# EAGLE design V9958 Video Card (EAGLE 4.16)
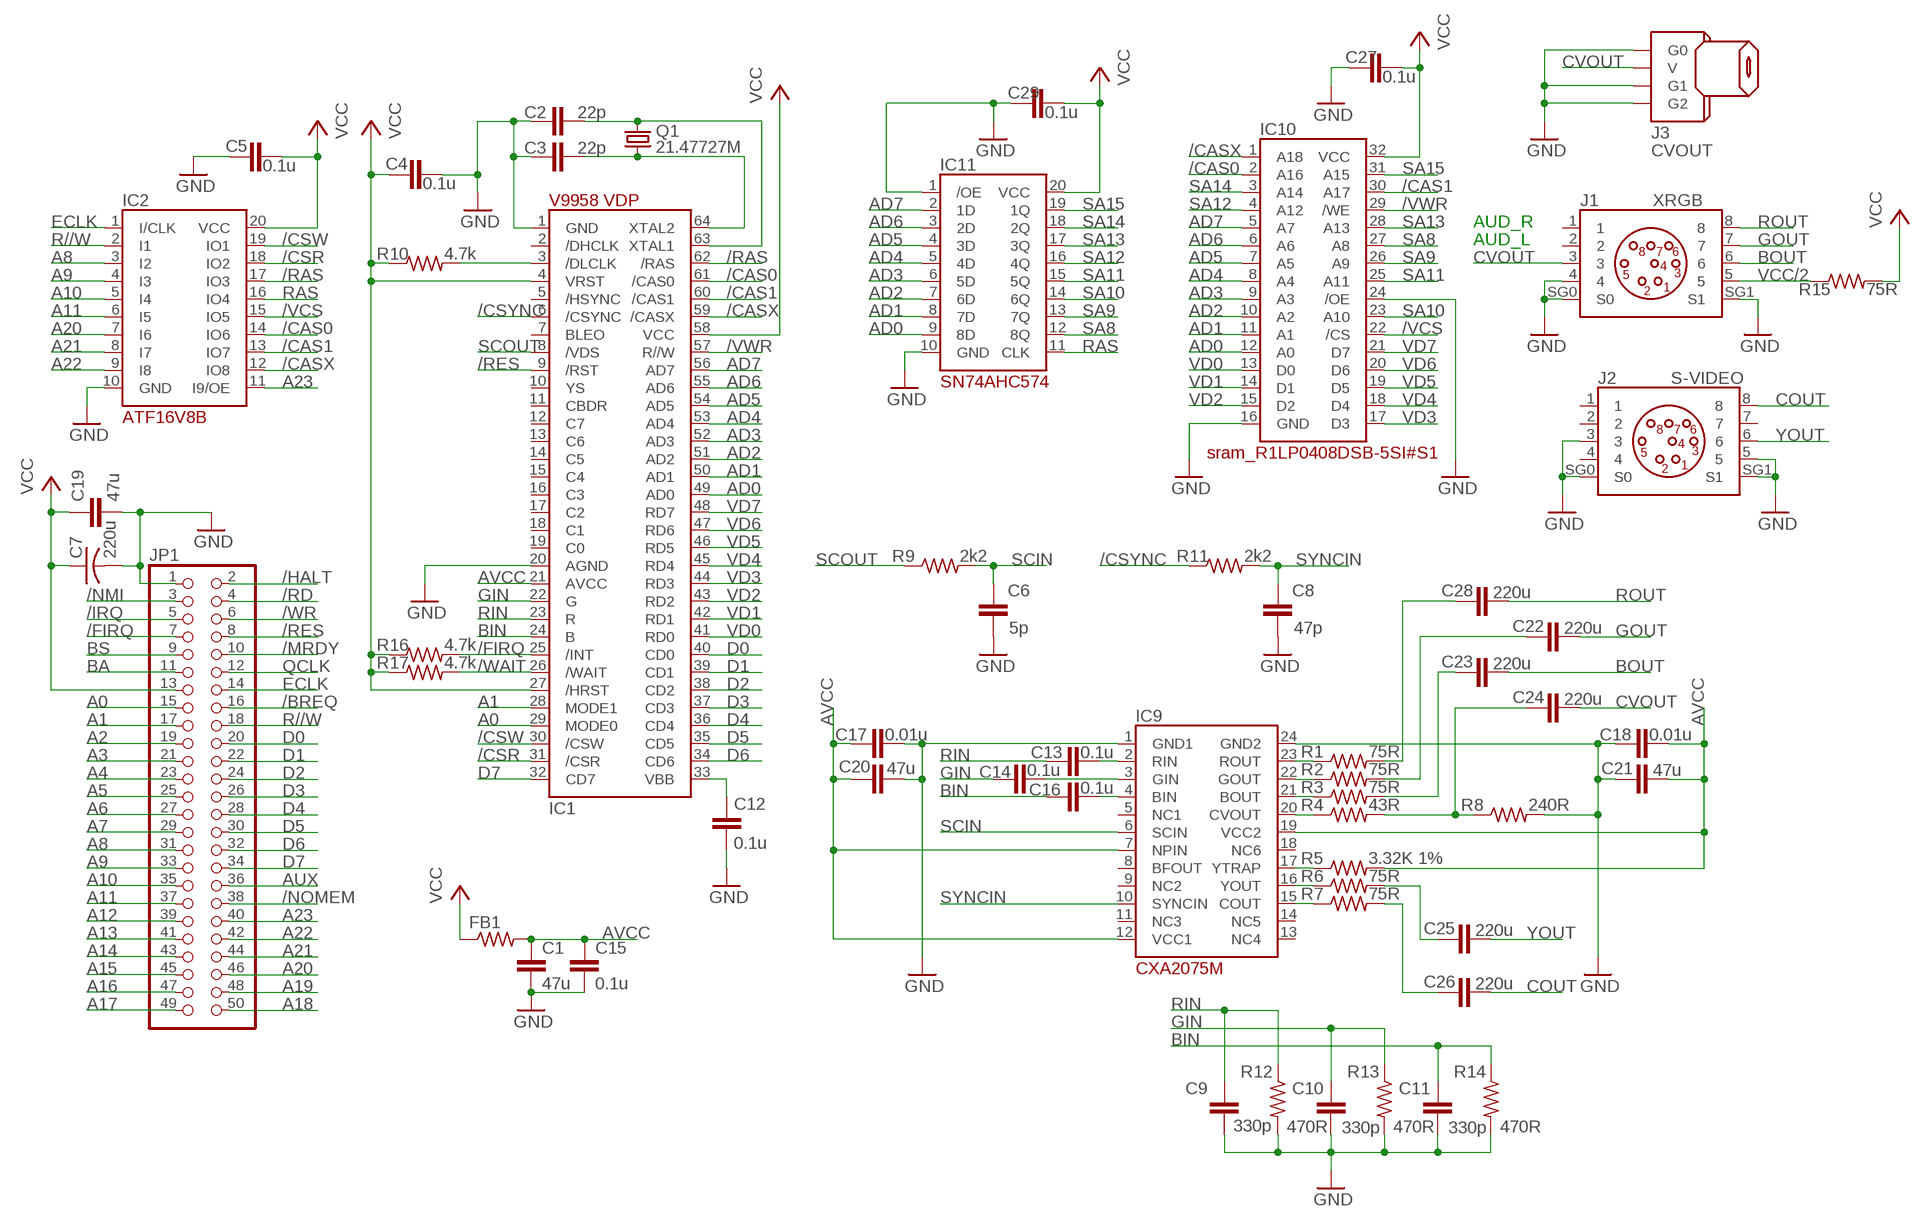
[diagram p0: schematic, sheet 1]

## Parts
C1  47u  C-EUC0805  [C0805]
C2  22p  C-EUC0603  [C0603]
C3  22p  C-EUC0603  [C0603]
C4  0.1u  C-EUC0603  [C0603]
C5  0.1u  C-EUC0603  [C0603]
C6  5p  C-EUC0603  [C0603]
C7  220u  C-US025-050X050  [C025-050X050]
C8  47p  C-EUC0603  [C0603]
C9  330p  C-EUC0603  [C0603]
C10  330p  C-EUC0603  [C0603]
C11  330p  C-EUC0603  [C0603]
C12  0.1u  C-EUC0603  [C0603]
C13  0.1u  C-EUC0603  [C0603]
C14  0.1u  C-EUC0603  [C0603]
C15  0.1u  C-EUC0603  [C0603]
C16  0.1u  C-EUC0603  [C0603]
C17  0.01u  C-EUC0603  [C0603]
C18  0.01u  C-EUC0603  [C0603]
C19  47u  C-EUC0805  [C0805]
C20  47u  C-EUC0805  [C0805]
C21  47u  C-EUC0805  [C0805]
C22  220u  C-EUC1206  [C1206]
C23  220u  C-EUC1206  [C1206]
C24  220u  C-EUC1206  [C1206]
C25  220u  C-EUC1206  [C1206]
C26  220u  C-EUC1206  [C1206]
C27  0.1u  C-EUC0603  [C0603]
C28  220u  C-EUC1206  [C1206]
C29  0.1u  C-EUC0603  [C0603]
FB1  R-US_R0603  [R0603]
IC1  YAMAHA_V9958  [V9958]
IC2  PLD_ATF16V8B  [DIL20]
IC9  CXA2075M  [CXA2075M]
IC10  R1LP0408DSB-5SI#S1  [RENESAS_32-TSOP-II]
IC11  SN74AHC574PWRSO  [SOIC20]
J1  XRGB  MINI-DIN8  [MINI_DIN8]
J2  S-VIDEO  MINI-DIN8  [MINI_DIN8]
J3  CVOUT  RCA_CONN_CUI_RCJ-014_CP-1403-ND  [RCA_JACK_CUI_RCJ-014_CP-1403-ND]
JP1  PINHD-2X25  [2X25]
Q1  21.47727M  CRYSTALHC49S  [HC49/S]
R1  75R  R-US_R0603  [R0603]
R2  75R  R-US_R0603  [R0603]
R3  75R  R-US_R0603  [R0603]
R4  43R  R-US_R0603  [R0603]
R5  3.32K 1%  R-US_R0603  [R0603]
R6  75R  R-US_R0603  [R0603]
R7  75R  R-US_R0603  [R0603]
R8  240R  R-US_R0603  [R0603]
R9  2k2  R-US_R0603  [R0603]
R10  4.7k  R-US_R0603  [R0603]
R11  2k2  R-US_R0603  [R0603]
R12  470R  R-US_R0603  [R0603]
R13  470R  R-US_R0603  [R0603]
R14  470R  R-US_R0603  [R0603]
R15  75R  R-US_R0603  [R0603]
R16  4.7k  R-US_R0603  [R0603]
R17  4.7k  R-US_R0603  [R0603]

## Nets
/BREQ: JP1.16
/CAS0: IC1.61(/CAS0) IC2.14(IO6) IC10.2(A16)
/CAS1: IC1.60(/CAS1) IC2.13(IO7) IC10.30(A17)
/CASX: IC1.59(/CASX) IC2.12(IO8) IC10.1(A18)
/CSR: IC1.31(/CSR) IC2.18(IO2)
/CSW: IC1.30(/CSW) IC2.19(IO1)
/CSYNC: IC1.6(/CSYNC) R11.1
/DLCLK: IC1.3(/DLCLK) R10.2
/FIRQ: IC1.25(/INT) JP1.7 R16.2
/HALT: JP1.2
/IRQ: JP1.5
/MRDY: JP1.10
/NMI: JP1.3
/NOMEM: JP1.38
/RAS: IC1.62(/RAS) IC2.17(IO3)
/RD: JP1.4
/RES: IC1.9(/RST) JP1.8
/VCS: IC2.15(IO5) IC10.22(/CS)
/VWR: IC1.57(R//W) IC10.29(/WE)
/WAIT: IC1.26(/WAIT) R17.2
/WR: JP1.6
A0: IC1.29(MODE0) JP1.15
A1: IC1.28(MODE1) JP1.17
A2: JP1.19
A3: JP1.21
A4: JP1.23
A5: JP1.25
A6: JP1.27
A7: JP1.29
A8: IC2.3(I2) JP1.31
A9: IC2.4(I3) JP1.33
A10: IC2.5(I4) JP1.35
A11: IC2.6(I5) JP1.37
A12: JP1.39
A13: JP1.41
A14: JP1.43
A15: JP1.45
A16: JP1.47
A17: JP1.49
A18: JP1.50
A19: JP1.48
A20: IC2.7(I6) JP1.46
A21: IC2.8(I7) JP1.44
A22: IC2.9(I8) JP1.42
A23: IC2.11(I9/OE) JP1.40
AD0: IC1.49(AD0) IC10.12(A0) IC11.9(8D)
AD1: IC1.50(AD1) IC10.11(A1) IC11.8(7D)
AD2: IC1.51(AD2) IC10.10(A2) IC11.7(6D)
AD3: IC1.52(AD3) IC10.9(A3) IC11.6(5D)
AD4: IC1.53(AD4) IC10.8(A4) IC11.5(4D)
AD5: IC1.54(AD5) IC10.7(A5) IC11.4(3D)
AD6: IC1.55(AD6) IC10.6(A6) IC11.3(2D)
AD7: IC1.56(AD7) IC10.5(A7) IC11.2(1D)
AUX: JP1.36
AVCC [supply]: C1.1 C15.1 C17.1 C18.2 C20.1 C21.2 FB1.2 IC1.21(AVCC) IC9.7(NPIN) IC9.12(VCC1) IC9.19(VCC2) R5.2
BA: JP1.11
BIN: C11.1 C16.1 IC1.24(B) R14.1
BOUT: C23.2 J1.6
BS: JP1.9
COUT: C26.2 J2.8
CVOUT: C24.2 J1.3 J3.V
D0: IC1.40(CD0) JP1.20
D1: IC1.39(CD1) JP1.22
D2: IC1.38(CD2) JP1.24
D3: IC1.37(CD3) JP1.26
D4: IC1.36(CD4) JP1.28
D5: IC1.35(CD5) JP1.30
D6: IC1.34(CD6) JP1.32
D7: IC1.32(CD7) JP1.34
ECLK: IC2.1(I/CLK) JP1.14
GIN: C10.1 C14.1 IC1.22(G) R13.1
GND: C1.2 C2.1 C3.1 C4.2 C5.1 C6.2 C7.2 C8.2 C9.2 C10.2 C11.2 C12.2 C15.2 C17.2 C18.1 C19.2 C20.2 C21.1 C27.1 C29.1 IC1.1(GND) IC1.20(AGND) IC2.10(GND) IC9.1(GND1) IC9.24(GND2) IC10.16(GND) IC10.24(/OE) IC11.1(/OE) IC11.10(GND) J1.4 J1.SG0(S0) J1.SG1(S1) J2.3 J2.5 J2.SG0(S0) J2.SG1(S1) J3.G0 J3.G1 J3.G2 JP1.1 R8.2 R12.2 R13.2 R14.2
GOUT: C22.2 J1.7
N$1: C2.2 IC1.63(XTAL1) Q1.2
N$2: C3.2 IC1.64(XTAL2) Q1.1
N$4: C13.2 IC9.2(RIN)
N$5: C14.2 IC9.3(GIN)
N$6: C16.2 IC9.4(BIN)
N$7: C26.1 R7.2
N$8: IC9.17(YTRAP) R5.1
N$9: IC9.23(ROUT) R1.1
N$10: IC9.22(GOUT) R2.1
N$11: IC9.21(BOUT) R3.1
N$12: IC9.20(CVOUT) R4.1
N$13: IC9.16(YOUT) R6.1
N$14: IC9.15(COUT) R7.1
N$15: C24.1 R4.2 R8.1
N$16: C25.1 R6.2
N$17: C23.1 R3.2
N$18: C22.1 R2.2
N$19: C28.1 R1.2
N$20: C12.1 IC1.33(VBB)
QCLK: JP1.12
R//W: IC2.2(I1) JP1.18
RAS: IC2.16(IO4) IC11.11(CLK)
RIN: C9.1 C13.1 IC1.23(R) R12.1
ROUT: C28.2 J1.8
SA8: IC10.27(A8) IC11.12(8Q)
SA9: IC10.26(A9) IC11.13(7Q)
SA10: IC10.23(A10) IC11.14(6Q)
SA11: IC10.25(A11) IC11.15(5Q)
SA12: IC10.4(A12) IC11.16(4Q)
SA13: IC10.28(A13) IC11.17(3Q)
SA14: IC10.3(A14) IC11.18(2Q)
SA15: IC10.31(A15) IC11.19(1Q)
SCIN: C6.1 IC9.6(SCIN) R9.2
SCOUT: IC1.8(/VDS) R9.1
SYNCIN: C8.1 IC9.10(SYNCIN) R11.2
VCC [supply]: C4.1 C5.2 C7.1 C19.1 C27.2 C29.2 FB1.1 IC1.4(VRST) IC1.27(/HRST) IC1.58(VCC) IC2.20(VCC) IC10.32(VCC) IC11.20(VCC) JP1.13 R10.1 R15.2 R16.1 R17.1
VCC/2: J1.5 R15.1
VD0: IC1.41(RD0) IC10.13(D0)
VD1: IC1.42(RD1) IC10.14(D1)
VD2: IC1.43(RD2) IC10.15(D2)
VD3: IC1.44(RD3) IC10.17(D3)
VD4: IC1.45(RD4) IC10.18(D4)
VD5: IC1.46(RD5) IC10.19(D5)
VD6: IC1.47(RD6) IC10.20(D6)
VD7: IC1.48(RD7) IC10.21(D7)
YOUT: C25.2 J2.6
Unconnected: IC1.2(/DHCLK) IC1.5(/HSYNC) IC1.7(BLEO) IC1.10(YS) IC1.11(CBDR) IC1.12(C7) IC1.13(C6) IC1.14(C5) IC1.15(C4) IC1.16(C3) IC1.17(C2) IC1.18(C1) IC1.19(C0) IC9.5(NC1) IC9.8(BFOUT) IC9.9(NC2) IC9.11(NC3) IC9.13(NC4) IC9.14(NC5) IC9.18(NC6) J1.1 J1.2 J2.1 J2.2 J2.4 J2.7

## Notes on the sheet
- AUD_R
- AUD_L

## Library data of the parts
C1-C6 C8-C29 = rcl:C-EU: CAPACITOR, European symbol
C7 = rcl:C-US: CAPACITOR, American symbol
FB1 R1-R17 = rcl:R-US_: RESISTOR, American symbol
IC1 = 07-Retrocomputing:YAMAHA_V9958
IC2 = 07-Retrocomputing:PLD_ATF16V8B
IC9 = 07-Retrocomputing:CXA2075M
IC10 = 07-Retrocomputing:R1LP0408DSB-5SI#S1
IC11 = 07-Retrocomputing:SN74AHC574PWR
J1 J2 = 07-Retrocomputing:MINI-DIN8
J3 = 07-Retrocomputing:RCA_CONN_CUI_RCJ-014_CP-1403-ND
JP1 = pinhead:PINHD-2X25: PIN HEADER
Q1 = crystal:CRYSTAL: CRYSTAL

## Net classes
0 default: width 0.203 mm, drill 0.203 mm, clearance 0.254 mm
1 supply: width 0.61 mm, drill 0.203 mm, clearance 0.305 mm

## Board
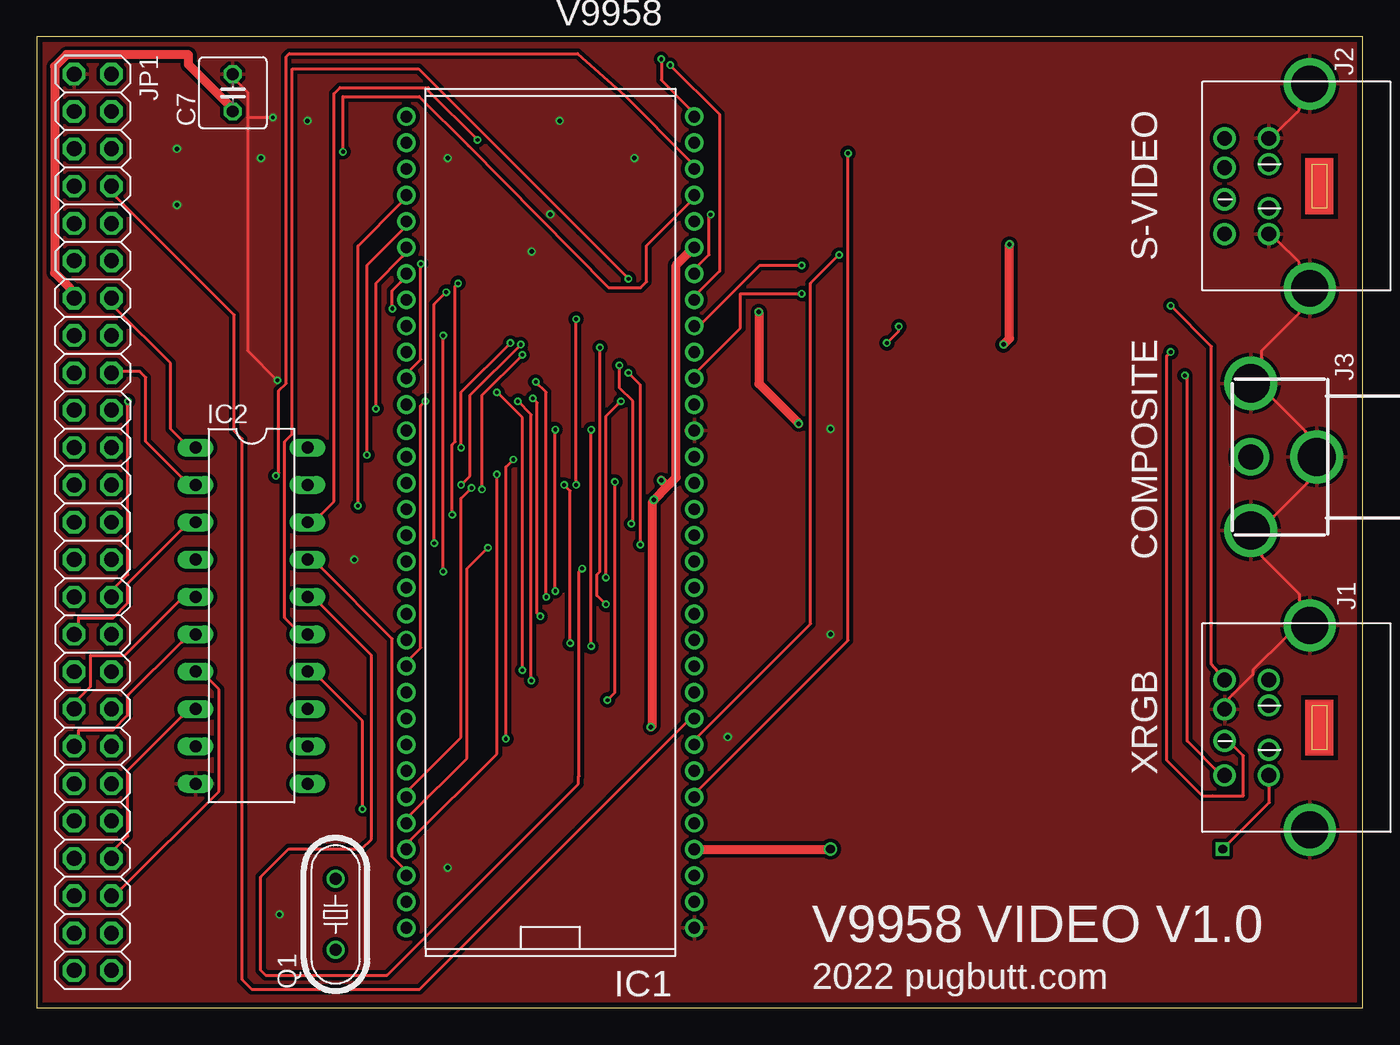
[diagram p1: board, top side]
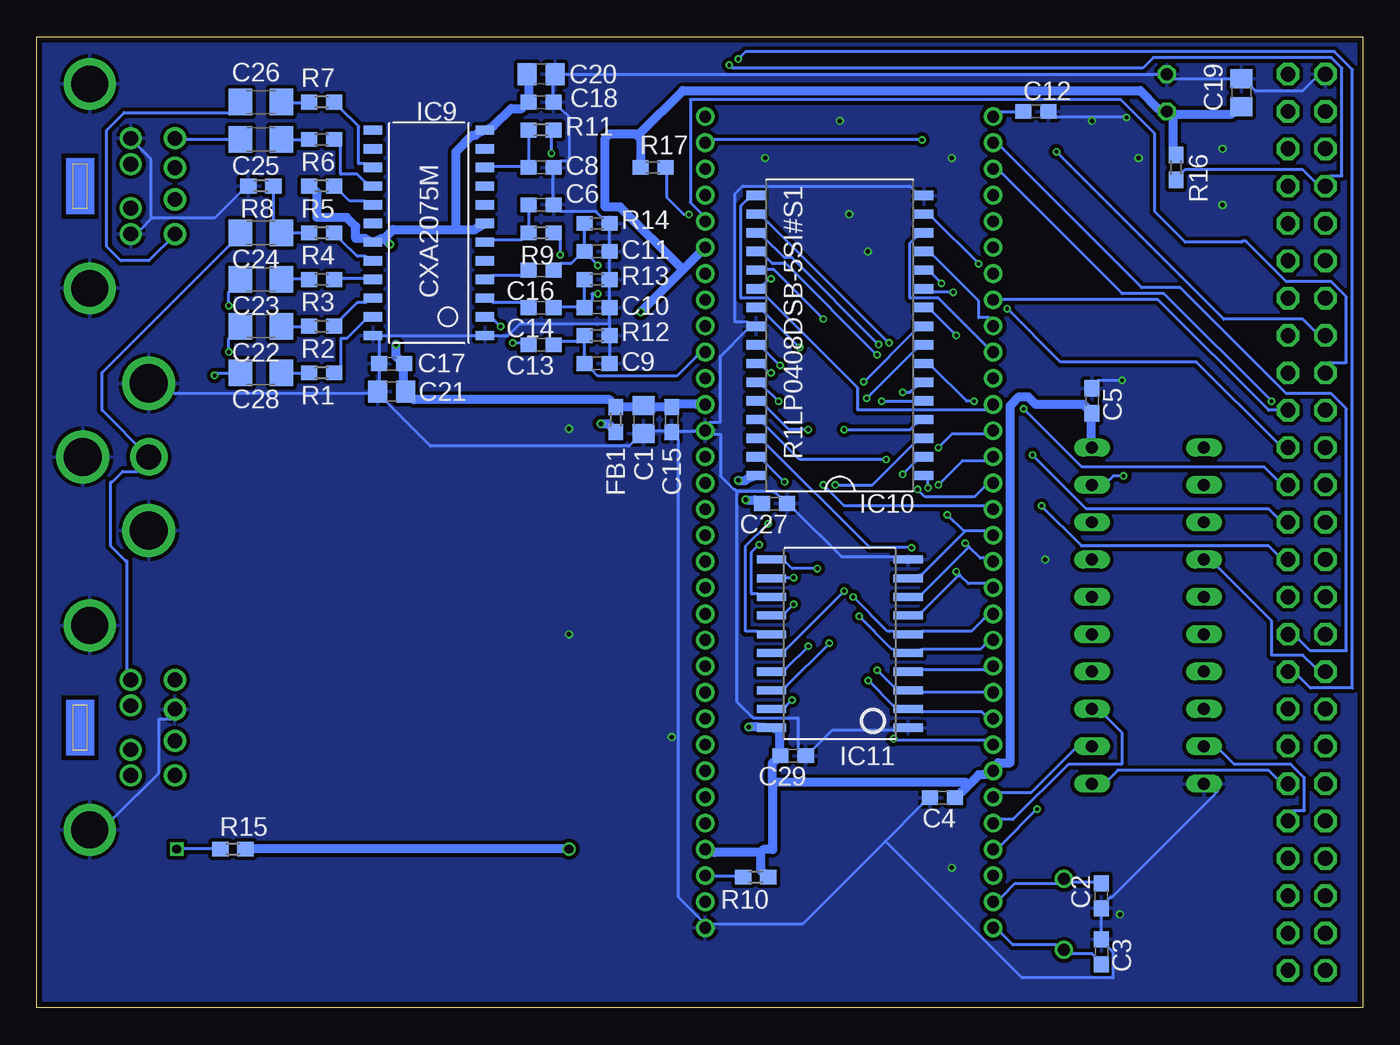
[diagram p2: board, bottom side, seen from below]

Size 90.17 x 66.04 mm. Coordinates in mm from the lower left corner, seen from the top.
Outline: 0,0 90.17,0 90.17,66.04 0,66.04 0,0
Copper layers (1*16): Top 0.0356mm / dielectric 1.6mm / Bottom 0.0356mm
Design rules "oshpark-2layer": minimum track width 6mil, minimum drill 10mil, track to track 6mil, track to pad 6mil, pad to pad 6mil, via to via 6mil, smd to smd 6mil, copper to edge 15mil, drill to drill 6mil, minimum pad ring 5mil, minimum via ring 5mil, stop-mask expansion 2.5mil, vias tented up to drill 0mil, thermal gap 10mil

### Footprints (pad centres in the part's own frame; a part is rotated, then mirrored left to right if it is on the bottom)
C0805 = smd 1.3 x 1.5: 1 -0.95,0; 2 0.95,0
C0603 = smd 1.1 x 1: 1 -0.85,0; 2 0.85,0
C025-050X050 = drill 0.813 octagon: 1 -1.27,0; 2 1.27,0
C1206 = smd 1.6 x 1.8: 1 -1.4,0; 2 1.4,0
R0603 = smd 1.1 x 1: 1 -0.85,0; 2 0.85,0
V9958 = drill 0.8 pad 1.27 round: 1 -27.59,-9.79; 2 -25.81,-9.79; 3 -24.03,-9.79; 4 -22.25,-9.79; 5 -20.47,-9.79; 6 -18.69,-9.79; 7 -16.91,-9.79; 8 -15.13,-9.79; 9 -13.35,-9.79; 10 -11.57,-9.79; 11 -9.79,-9.79; 12 -8.01,-9.79; 13 -6.23,-9.79; 14 -4.45,-9.79; 15 -2.67,-9.79; 16 -0.89,-9.79; 17 0.89,-9.79; 18 2.67,-9.79; 19 4.45,-9.79; 20 6.23,-9.79; 21 8.01,-9.79; 22 9.79,-9.79; 23 11.57,-9.79; 24 13.35,-9.79; 25 15.13,-9.79; 26 16.91,-9.79; 27 18.69,-9.79; 28 20.47,-9.79; 29 22.25,-9.79; 30 24.03,-9.79; 31 25.81,-9.79; 32 27.59,-9.79; 33 27.59,9.79; 34 25.81,9.79; 35 24.03,9.79; 36 22.25,9.79; 37 20.47,9.79; 38 18.69,9.79; 39 16.91,9.79; 40 15.13,9.79; 41 13.35,9.79; 42 11.57,9.79; 43 9.79,9.79; 44 8.01,9.79; 45 6.23,9.79; 46 4.45,9.79; 47 2.67,9.79; 48 0.89,9.79; 49 -0.89,9.79; 50 -2.67,9.79; 51 -4.45,9.79; 52 -6.23,9.79; 53 -8.01,9.79; 54 -9.79,9.79; 55 -11.57,9.79; 56 -13.35,9.79; 57 -15.13,9.79; 58 -16.91,9.79; 59 -18.69,9.79; 60 -20.47,9.79; 61 -22.25,9.79; 62 -24.03,9.79; 63 -25.81,9.79; 64 -27.59,9.79
DIL20 = drill 0.813 long: 1 -11.43,-3.81; 2 -8.89,-3.81; 3 -6.35,-3.81; 4 -3.81,-3.81; 5 -1.27,-3.81; 6 1.27,-3.81; 7 3.81,-3.81; 8 6.35,-3.81; 9 8.89,-3.81; 10 11.43,-3.81; 11 11.43,3.81; 12 8.89,3.81; 13 6.35,3.81; 14 3.81,3.81; 15 1.27,3.81; 16 -1.27,3.81; 17 -3.81,3.81; 18 -6.35,3.81; 19 -8.89,3.81; 20 -11.43,3.81
CXA2075M = smd 1.27 x 0.635: 1 -3.81,6.985; 2 -3.81,5.715; 3 -3.81,4.445; 4 -3.81,3.175; 5 -3.81,1.905; 6 -3.81,0.635; 7 -3.81,-0.635; 8 -3.81,-1.905; 9 -3.81,-3.175; 10 -3.81,-4.445; 11 -3.81,-5.715; 12 -3.81,-6.985; 13 3.81,-6.985; 14 3.81,-5.715; 15 3.81,-4.445; 16 3.81,-3.175; 17 3.81,-1.905; 18 3.81,-0.635; 19 3.81,0.635; 20 3.81,1.905; 21 3.81,3.175; 22 3.81,4.445; 23 3.81,5.715; 24 3.81,6.985
RENESAS_32-TSOP-II = smd 1.27 x 0.635: 1 -5.715,9.525; 2 -5.715,8.255; 3 -5.715,6.985; 4 -5.715,5.715; 5 -5.715,4.445; 6 -5.715,3.175; 7 -5.715,1.905; 8 -5.715,0.635; 9 -5.715,-0.635; 10 -5.715,-1.905; 11 -5.715,-3.175; 12 -5.715,-4.445; 13 -5.715,-5.715; 14 -5.715,-6.985; 15 -5.715,-8.255; 16 -5.715,-9.525; 17 5.715,-9.525; 18 5.715,-8.255; 19 5.715,-6.985; 20 5.715,-5.715; 21 5.715,-4.445; 22 5.715,-3.175; 23 5.715,-1.905; 24 5.715,-0.635; 25 5.715,0.635; 26 5.715,1.905; 27 5.715,3.175; 28 5.715,4.445; 29 5.715,5.715; 30 5.715,6.985; 31 5.715,8.255; 32 5.715,9.525
SOIC20 = smd 2 x 0.55: 1 -4.645,5.715; 2 -4.645,4.445; 3 -4.645,3.175; 4 -4.645,1.905; 5 -4.645,0.635; 6 -4.645,-0.635; 7 -4.645,-1.905; 8 -4.645,-3.175; 9 -4.645,-4.445; 10 -4.645,-5.715; 11 4.645,-5.715; 12 4.645,-4.445; 13 4.645,-3.175; 14 4.645,-1.905; 15 4.645,-0.635; 16 4.645,0.635; 17 4.645,1.905; 18 4.645,3.175; 19 4.645,4.445; 20 4.645,5.715
MINI_DIN8 = drill 1 round: 1 1.5,8.3; 2 -1.5,8.3; 3 3.25,8.3; 4 1.25,11.3; 5 -3.25,8.3; 6 3.25,11.3; 7 -0.9,11.3; 8 -3.25,11.3 | drill 2.5 round: SG0 -6.95,5.5; SG1 6.95,5.5
RCA_JACK_CUI_RCJ-014_CP-1403-ND = drill 2.6 round: G0 -5,0; G1 0,4.5; G2 5,0 | drill 1.7 round: V 0,0
2X25 = drill 1.016 octagon: 1 -30.48,-1.27; 2 -30.48,1.27; 3 -27.94,-1.27; 4 -27.94,1.27; 5 -25.4,-1.27; 6 -25.4,1.27; 7 -22.86,-1.27; 8 -22.86,1.27; 9 -20.32,-1.27; 10 -20.32,1.27; 11 -17.78,-1.27; 12 -17.78,1.27; 13 -15.24,-1.27; 14 -15.24,1.27; 15 -12.7,-1.27; 16 -12.7,1.27; 17 -10.16,-1.27; 18 -10.16,1.27; 19 -7.62,-1.27; 20 -7.62,1.27; 21 -5.08,-1.27; 22 -5.08,1.27; 23 -2.54,-1.27; 24 -2.54,1.27; 25 0,-1.27; 26 0,1.27; 27 2.54,-1.27; 28 2.54,1.27; 29 5.08,-1.27; 30 5.08,1.27; 31 7.62,-1.27; 32 7.62,1.27; 33 10.16,-1.27; 34 10.16,1.27; 35 12.7,-1.27; 36 12.7,1.27; 37 15.24,-1.27; 38 15.24,1.27; 39 17.78,-1.27; 40 17.78,1.27; 41 20.32,-1.27; 42 20.32,1.27; 43 22.86,-1.27; 44 22.86,1.27; 45 25.4,-1.27; 46 25.4,1.27; 47 27.94,-1.27; 48 27.94,1.27; 49 30.48,-1.27; 50 30.48,1.27
HC49/S = drill 0.813 round: 1 -2.413,0; 2 2.413,0

### Placement (x,y rotation side)
C1  48.9,40.01 270 bottom
C2  17.78,7.62 90 bottom
C3  17.78,3.81 270 bottom
C4  28.57,14.29 180 bottom
C5  18.41,41.27 270 bottom
C6  55.88,54.61 0 bottom
C7  13.34,62.23 90 top
C8  55.88,57.15 0 bottom
C9  52.07,43.81 0 bottom
C10  52.07,47.62 0 bottom
C11  52.07,51.44 0 bottom
C12  22.23,60.96 0 bottom
C13  55.88,45.09 180 bottom
C14  55.88,47.62 180 bottom
C15  46.99,40.01 270 bottom
C16  55.88,50.16 180 bottom
C17  66.04,43.81 180 bottom
C18  55.88,61.59 180 bottom
C19  8.26,62.23 90 bottom
C20  55.88,63.5 0 bottom
C21  66.04,41.91 0 bottom
C22  74.93,46.35 180 bottom
C23  74.93,49.53 180 bottom
C24  74.93,52.7 180 bottom
C25  74.93,59.05 180 bottom
C26  74.93,61.59 180 bottom
C27  40.01,34.29 180 bottom
C28  74.93,43.18 180 bottom
C29  38.73,17.14 180 bottom
FB1  50.8,40.01 90 bottom
IC1  34.92,33.02 90 top
IC2  14.61,26.67 270 top
IC9  63.5,52.7 180 bottom
IC10  35.56,45.72 180 bottom
IC11  35.56,24.77 180 bottom
J1  92.08,19.05 90 top
J2  92.08,55.88 90 top
J3  82.55,37.47 270 top
JP1  3.81,33.02 270 top
Q1  20.32,6.35 90 top
R1  70.8,43.18 180 bottom
R2  70.8,46.35 180 bottom
R3  70.8,49.53 180 bottom
R4  70.8,52.7 180 bottom
R5  70.8,55.88 180 bottom
R6  70.8,59.05 180 bottom
R7  70.8,61.59 180 bottom
R8  74.93,55.88 180 bottom
R9  55.88,52.7 180 bottom
R10  41.27,8.89 180 bottom
R11  55.88,59.69 180 bottom
R12  52.07,45.72 0 bottom
R13  52.07,49.53 0 bottom
R14  52.07,53.34 0 bottom
R15  76.83,10.79 0 bottom
R16  12.7,57.15 270 bottom
R17  48.26,57.15 0 bottom

### Tracks (layer width: path | path; a pad name or v marks a point on that pad's centre or on a via)
/CAS0  (via drill 0.25)
  Top 0.203: v31.29,36.27 31.29,17.27 25.4,11.38 IC1.61 | v22.15,13.51 22.15,19.51 19.3,22.35 IC2.14
  Bottom 0.203: v31.29,36.27 30.38,37.19 IC10.2 | v22.15,13.51 24.59,11.07 IC1.61
/CAS1  (via drill 0.25)
  Top 0.203: v30.68,31.29 29.26,29.87 29.26,16.97 25.4,13.11 IC1.60
  Bottom 0.203: v30.68,31.29 33.53,31.29 40.74,38.51 IC10.30 | IC2.13 17.48,19.81 16.36,18.69 16.36,16.56 20.02,16.56 23.77,12.8 24.59,12.8 IC1.60
/CASX  (via drill 0.25)
  Top 0.203: v29.57,35.36 28.85,34.65 28.85,18.39 25.4,14.94 IC1.59
  Bottom 0.203: v29.57,35.36 29.57,35.97 IC10.1 | IC2.12 19.61,17.58 22.55,14.63 24.59,14.63 IC1.59
/CSR  (via drill 0.25)
  Top 0.203: v29.97,59.03 26.62,62.38 26.62,62.59 20.62,62.59 20.22,62.18 20.22,34.44 19.3,33.53 IC2.18
  Bottom 0.203: v29.97,59.03 44.09,59.03 IC1.31
/CSW  (via drill 0.25)
  Top 0.203: v16.26,36.17 16.46,36.37 16.46,41.96 16.97,42.47 16.97,64.69 17.17,64.9 36.78,64.9 39.95,62.05 44.4,57.61 IC1.30
  Bottom 0.203: v16.26,36.17 16.97,36.17 17.27,35.87 IC2.19
/CSYNC  (via drill 0.25)
  Top 0.203: v55.17,58.12 55.17,24.99 45.01,14.83 IC1.6
  Bottom 0.203: v55.17,58.12 55.17,59.23 R11.1
/DLCLK
  Bottom 0.203: R10.2 42.67,8.94 44.09,8.94 IC1.3
/FIRQ  (via drill 0.25)
  Top 0.203: v43.08,64.11 46.43,60.76 46.43,50.09 45.01,48.67 IC1.25
  Bottom 0.203: R16.2 12.29,56.79 12.09,57 4.06,57 3.25,56.19 JP1.7 2.23,56.59 1.42,56.59 1.42,63.91 2.13,64.62 14.25,64.62 14.96,63.91 42.88,63.91 v43.08,64.11
/RAS
  Top 0.203: IC2.17 19.3,29.97 24.18,25.09 24.18,10.26 24.89,9.55 IC1.62
/RES
  Top 0.203: JP1.8 5.38,55.17 13.44,47.12 13.44,39.22 13.97,38.68 13.97,1.91 14.61,1.27 26.04,1.27 44.45,19.68 44.7,19.68 IC1.9
/VCS  (via drill 0.25)
  Top 0.203: v40.23,49.58 25.96,63.86 17.37,63.86 17.37,39.01 16.87,38.51 16.87,26.52 17.48,25.91 IC2.15
  Bottom 0.203: v40.23,49.58 40.34,49.58 40.74,49.17 IC10.22
/VWR  (via drill 0.25)
  Top 0.203: v32.41,37.29 31.9,36.78 v31.9,18.29
  Bottom 0.203: v32.41,37.29 38.3,37.29 40.74,39.73 IC10.29 | v31.9,18.29 31.8,18.19 25.7,18.19 IC1.57
/WAIT  (via drill 0.25)
  Top 0.203: v45.82,53.95 45.72,53.85 45.72,51.21 45.01,50.49 IC1.26
  Bottom 0.203: 45.74,53.95 v45.82,53.95 46.17,53.95 47.31,55.09 47.31,56.99 47.47,57.15 R17.2
A0  (via drill 0.25)
  Top 0.203: v20.83,58.22 20.83,61.98 26.01,61.98 29.36,58.62 38.89,48.97 41.07,48.97 41.48,49.38 41.48,51.84 44.4,54.76 IC1.29
  Bottom 0.203: v20.83,58.22 9.45,46.84 4.06,46.84 3.25,46.02 JP1.15
A1
  Bottom 0.203: IC1.28 45.01,54.05 45.72,54.76 45.72,61.77 16.46,61.77 14.15,59.46 14.15,54.15 12.06,52.07 8.26,52.07 8.18,52.15 7.95,52.15 5.18,49.38 2.13,49.38 1.12,48.36 1.12,43.89 2.23,43.89 JP1.17
A8
  Top 0.203: IC2.3 9.86,32.51 6.2,28.85 6.2,27.53 5.18,26.52 2.85,26.52 2.85,26.11 JP1.31
A9
  Bottom 0.203: IC2.4 9.86,29.97 6.2,26.31 6.2,23.98 4.06,23.98 3.25,23.16 JP1.33
A10
  Top 0.203: IC2.5 9.65,27.64 5.99,23.98 3.66,23.98 3.66,21.84 2.85,21.03 JP1.35
A11
  Top 0.203: IC2.6 9.86,24.89 6.2,21.23 6.2,19.91 5.18,18.9 2.85,18.9 2.85,18.49 JP1.37
A20
  Top 0.203: IC2.7 11.68,22.35 12.39,21.64 12.39,14.73 5.69,8.03 JP1.46
A21
  Top 0.203: IC2.8 9.86,19.81 6.2,16.15 6.2,11.68 5.38,10.87 JP1.44
A22
  Bottom 0.203: IC2.9 9.65,17.48 8.74,16.56 4.88,16.56 3.96,15.65 3.96,13.41 4.78,13.41 JP1.42
A23
  Bottom 0.203: IC2.11 17.27,15.54 16.66,16.15 6.4,16.15 5.79,15.54 JP1.40
AD0  (via drill 0.25)
  Top 0.203: v28.65,49.28 28.45,49.07 28.45,38.51 28.25,38.3 v28.25,33.53
  Bottom 0.203: v28.65,49.28 29.26,49.89 IC10.12 | v28.25,33.53 27.13,32.41 27.03,32.41 | 27.03,32.41 25.7,32.41 IC1.49 | 27.03,32.41 29.97,29.46 IC11.9
AD1  (via drill 0.25)
  Top 0.203: v27.84,48.67 27.03,47.85 v27.03,31.6
  Bottom 0.203: v27.84,48.67 29.26,48.67 IC10.11 | 26.77,31.34 26.01,30.58 25.7,30.58 IC1.50 | 26.77,31.34 v27.03,31.6 | IC11.8 29.97,28.14 26.77,31.34
AD2  (via drill 0.25)
  Top 0.203: v27.64,29.67 v27.64,45.72
  Bottom 0.203: v27.64,45.72 29.26,47.35 IC10.10 | 27.38,29.41 26.82,28.85 25.7,28.85 IC1.51 | 27.38,29.41 v27.64,29.67 | IC11.7 29.97,26.92 27.53,29.36 27.43,29.36 27.38,29.41
AD3  (via drill 0.25)
  Top 0.203: v33.93,42.57 34.65,41.86 v34.65,27.94
  Bottom 0.203: v33.93,42.57 30.38,46.13 IC10.9 | v34.65,27.94 32.31,25.6 31.9,25.6 IC11.6 29.97,25.6 26.62,25.6 25.7,26.52 IC1.52
AD4  (via drill 0.25)
  Top 0.203: v33.73,41.45 34.04,41.15 34.04,26.82 v34.24,26.62
  Bottom 0.203: v33.73,41.45 30.38,44.81 IC10.8 | v34.24,26.62 32,24.38 31.9,24.38 IC11.5 29.97,24.38 26.01,24.38 25.7,24.69 IC1.53
AD5  (via drill 0.25)
  Top 0.203: v26.42,41.25 26.11,40.95 26.11,24.49 25.4,23.77 IC1.54
  Bottom 0.203: v26.42,41.25 26.92,41.25 29.26,43.59 IC10.7 | IC11.4 29.97,22.96 25.7,22.96 IC1.54
AD6  (via drill 0.25)
  Top 0.203: v31.29,41.86 33.02,40.13 v33.02,22.96
  Bottom 0.203: v31.29,41.86 30.79,41.86 30.38,42.27 IC10.6 | v33.02,22.96 31.9,21.84 IC11.3 29.97,21.44 25.7,21.44 IC1.55
AD7  (via drill 0.25)
  Top 0.203: v32.72,41.25 33.63,40.34 v33.63,22.25
  Bottom 0.203: v32.72,41.25 30.38,41.25 IC10.5 | v33.63,22.25 31.9,20.52 IC11.2 29.97,20.12 25.91,20.12 25.7,19.91 IC1.56
AVCC  (via drill 0.3)
  Top 0.61: v65.73,45.11 66.14,45.52 v66.14,51.92
  Bottom 0.61: IC1.21 45.31,41.05 46.53,41.05 C15.1 47.45,40.84 48.16,40.84 C1.1 49.58,40.84 50.39,40.84 FB1.2 51.21,41.35 64.52,41.35 C21.2 65.23,42.57 65.23,43.38 C17.1 65.73,44.3 v65.73,45.11 | C20.1 56.69,62.79 56.69,62.08 C18.2 57.2,61.16 57.91,61.16 59.13,59.94 IC9.12 60.25,59.44 60.35,59.33 60.55,59.33 61.67,58.22 61.67,52.93 | R5.2 71.12,55.47 71.12,53.75 69.09,53.75 68.48,53.14 68.48,52.32 67.87,52.32 IC9.19 66.75,52.32 66.55,52.32 | 61.67,52.93 65.94,52.93 66.55,52.32 | 61.67,52.93 60.35,52.93 60.25,53.03 IC9.7 | v66.14,51.92 66.55,52.32
BIN  (via drill 0.25)
  Top 0.203: v52.02,50.49 49.17,50.49 45.31,46.63 IC1.24
  Bottom 0.203: C11.1 52.93,51.92 52.93,52.93 R14.1 | C16.1 54.56,50.6 53.85,50.6 53.44,51 C11.1 | v52.02,50.49 52.53,51 C11.1
BOUT  (via drill 0.25)
  Top 0.203: v77.11,47.75 79.89,44.98 79.89,23.34 J1.6
  Bottom 0.203: v77.11,47.75 77.11,48.67 C23.2
COUT
  Bottom 0.203: C26.2 76.48,61.39 76.99,60.88 84.23,60.88 85.41,59.7 85.41,51.75 84.45,50.8 82.55,50.8 80.8,52.55 80.8,52.66 | 80.8,52.66 80.8,52.7 | J2.8 80.8,52.66
CVOUT
  Bottom 0.203: C24.2 77.11,51.82 85.72,43.2 85.72,40.64 J3.V 83.31,36.47 84.33,36.47 85.04,35.76 85.14,35.76 85.14,31.39 84.12,30.38 84.02,30.38 84.02,22.96 J1.3
D0
  Bottom 0.203: IC1.40 24.59,48.16 13.92,48.16 6.4,40.64 JP1.20
D1  (via drill 0.25)
  Top 0.203: v24.18,47.55 24.18,48.77 24.79,49.38 IC1.39
  Bottom 0.203: v24.18,47.55 20.55,43.92 11.3,43.92 5.79,38.41 JP1.22
D2  (via drill 0.25)
  Top 0.203: v23.06,40.74 23.06,49.28 24.89,51.1 IC1.38
  Bottom 0.203: v23.06,40.74 19.1,36.78 6.71,36.78 5.79,35.87 JP1.24
D3  (via drill 0.25)
  Top 0.203: v22.45,37.59 22.45,50.49 24.89,52.93 IC1.37
  Bottom 0.203: v22.45,37.59 18.8,33.93 6.4,33.93 5.79,33.33 JP1.26
D4  (via drill 0.25)
  Top 0.203: v21.84,34.14 21.84,51.82 24.79,54.76 IC1.36
  Bottom 0.203: v21.84,34.14 19.1,31.39 6.4,31.39 5.79,30.79 JP1.28
D5  (via drill 0.25)
  Top 0.203: v6.2,41.25 6.2,29.46 5.38,28.65 JP1.30
  Bottom 0.203: v6.2,41.25 13.51,48.56 16.36,48.56 24.59,56.79 IC1.35
D6
  Bottom 0.203: IC1.34 24.59,58.52 15.04,48.97 12.39,48.97 5.18,41.76 2.13,41.76 1.12,40.74 1.12,24.28 3.56,24.28 4.37,25.09 JP1.32
D7  (via drill 0.25)
  Top 0.203: v42.47,64.52 42.47,63.09 44.4,61.16 IC1.32
  Bottom 0.203: v42.47,64.52 41.96,65.02 1.93,65.02 0.71,63.8 0.71,21.74 3.56,21.74 4.37,22.55 JP1.34
ECLK
  Top 0.203: IC2.1 9.86,38.61 9.09,39.37 9.09,43.84 5.38,47.55 JP1.14
GIN  (via drill 0.25)
  Top 0.203: v52.02,48.56 47.85,48.56 47.85,46.23 45.01,43.38 IC1.22
  Bottom 0.203: C10.1 52.93,48.06 52.93,49.07 R13.1 | C14.1 54.56,47.65 53.44,47.65 C10.1 | v52.02,48.56 52.43,48.56 52.43,48.06 C10.1
GND  (via drill 0.25, 0.3)
  Top 0.203: v16.36,42.67 14.33,44.7 14.33,60.55 | 14.33,60.55 14.33,62.28 13.61,62.99 C7.2 | 14.33,60.55 v16.05,60.55 | J2.3 84.33,59.54 85.85,61.06 85.85,61.16 J2.SG1 | J2.5 84.33,52.22 85.85,50.7 85.85,50.6 J2.SG0 85.85,47.24 83.31,44.7 83.31,44.2 J3.G0 84.02,41.45 86.26,39.22 J3.G1 86.36,35.66 84.12,33.43 J3.G2 83.31,30.68 85.85,28.14 85.85,27.74 J1.SG1 84.94,25.2 82.7,22.96 82.7,22.66 81.08,21.03 J1.4
  Bottom 0.203: IC2.10 9.86,14.73 17.07,7.52 17.17,7.52 17.37,7.32 C2.1 C3.1 17.37,4.17 16.97,3.76 16.97,2.03 23.16,2.03 32.46,11.33 | 32.46,11.33 38.1,5.69 44.09,5.69 IC1.1 45.01,5.99 46.53,7.52 46.53,38.61 C15.2 | 32.46,11.33 29.97,13.82 C4.2 | IC11.1 31.9,18.9 36.07,18.9 37.39,17.58 C29.1 38.41,17.58 38.41,19.71 41.45,19.71 42.57,20.83 42.57,35.15 | IC11.10 31.9,30.68 35.46,30.68 38.61,33.83 C27.1 39.62,34.75 40.03,35.15 42.57,35.15 | C15.2 47.45,39.22 48.16,39.22 C1.2 49.58,38.51 49.89,38.2 63.4,38.2 66.45,41.25 C21.1 | IC1.20 44.4,39.83 43.69,39.83 43.69,44.3 41.86,46.13 IC10.24 41.86,46.63 42.67,46.63 42.67,55.37 42.16,55.88 30.79,55.88 30.38,55.47 IC10.16 | C15.2 46.53,39.22 45.31,39.22 IC1.20 | 42.57,35.15 42.67,35.26 42.77,35.26 43.69,36.17 43.69,39.01 44.09,39.01 IC1.20 | v16.36,42.67 17.98,42.67 C5.1 | v16.05,60.55 20.83,60.55 C12.2 | JP1.1 3.25,63.2 4.06,62.38 7.32,62.38 7.52,62.59 C19.2 8.94,63.2 12.8,63.2 C7.2 C20.2 55.07,62.79 55.07,62.08 C18.1 54.56,61.16 53.95,60.55 53.95,57.61 54.56,57.61 C8.2 55.07,56.69 55.07,55.07 C6.2 54.56,54.15 52.12,54.15 51.71,53.75 R14.2 51.21,52.93 51.21,51.92 C11.2 51.21,51 51.21,49.99 R13.2 51.21,49.07 51.21,48.06 C10.2 51.21,47.14 51.21,46.53 | C21.1 66.85,42.57 66.85,43.38 C17.2 66.85,44.3 66.85,45.41 IC9.24 IC9.1 58.12,45.72 57.3,46.53 51.21,46.53 | C9.2 51.21,44.3 51.21,45.31 R12.2 51.21,46.13 51.21,46.53 | 82.35,53.7 83.11,52.93 J2.5 | 82.35,53.7 82.3,53.75 78.03,53.75 76.3,55.47 R8.2 | J2.3 83.31,58.62 82.4,57.71 82.4,53.75 82.35,53.7 | J1.SG0 84.94,12.9 81.89,15.95 81.89,19.61 81.08,19.61 J1.4
  Bottom 0.203: C21.1 67.56,41.76 80.77,41.76 J3.G0
  other vias: 46.99,18.41 53.98,25.4 53.98,39.37 15.24,57.78 9.53,58.42 9.53,54.61 18.41,60.33 16.51,6.35 27.94,57.78 35.56,60.33 34.92,53.98 33.66,51.44 40.64,57.78 27.94,9.53 21.59,30.48
  pour Top: 0,66.04 90.17,66.04 90.17,0 0,0
  pour Bottom: 0,66.04 90.17,66.04 90.17,0 0,0
GOUT  (via drill 0.25)
  Top 0.203: J1.7 81.08,18.11 82.05,17.14 82.05,14.41 79.95,14.41 79.25,14.41 76.83,16.83 76.83,44.32 v77.11,44.6
  Bottom 0.203: v77.11,44.6 77.11,45.52 C22.2
N$1
  Bottom 0.203: C2.2 18.19,8.53 19.81,8.53 Q1.2 20.83,8.43 23.67,8.43 24.59,7.52 IC1.63
N$2
  Bottom 0.203: C3.2 18.19,3.45 18.39,3.66 19.81,3.66 Q1.1 20.83,4.27 23.77,4.27 24.59,5.08 IC1.64
N$4  (via drill 0.25)
  Top 0.203: v57.81,45.21 58.62,46.02 v58.62,46.33
  Bottom 0.203: v57.81,45.21 57.2,45.21 C13.2 | v58.62,46.33 59.03,46.74 59.13,46.74 IC9.2
N$5
  Bottom 0.203: C14.2 57.2,47.95 59.13,47.95 IC9.3
N$6
  Bottom 0.203: C16.2 57.2,49.78 59.13,49.78 IC9.4
N$7
  Bottom 0.203: R7.2 72.14,61.57 72.75,61.57 C26.1
N$8
  Bottom 0.203: R5.1 69.49,55.47 68.89,54.86 67.87,54.86 IC9.17
N$9
  Bottom 0.203: R1.1 69.49,43.59 69.49,45.52 69.09,45.52 67.87,46.74 IC9.23
N$10
  Bottom 0.203: R2.1 69.49,46.84 68.38,47.95 67.87,47.95 IC9.22
N$11
  Bottom 0.203: R3.1 69.49,49.58 67.87,49.58 IC9.21
N$12
  Bottom 0.203: R4.1 69.49,52.22 68.38,51.1 67.87,51.1 IC9.20
N$13
  Bottom 0.203: R6.1 69.49,58.62 69.49,56.69 68.38,56.69 67.87,56.19 IC9.16
N$14
  Bottom 0.203: R7.1 69.49,61.16 68.28,59.94 68.28,57.4 67.87,57.4 IC9.15
N$15
  Bottom 0.203: R4.2 72.14,52.73 72.75,52.73 C24.1 74.07,53.54 74.07,55.47 R8.1
N$16
  Bottom 0.203: R6.2 72.14,59.03 72.75,59.03 C25.1
N$17
  Bottom 0.203: R3.2 72.14,49.58 72.75,49.58 C23.1
N$18
  Bottom 0.203: R2.2 72.14,46.33 72.75,46.33 C22.1
N$19
  Bottom 0.203: C28.1 R1.2
N$20
  Bottom 0.203: C12.1 24.59,60.96 IC1.33
R//W
  Top 0.203: IC2.2 9.86,36.07 7.42,38.51 7.42,42.88 7.01,43.28 5.79,43.28 JP1.18
RAS  (via drill 0.25)
  Top 0.203: v37.08,29.87 36.88,29.67 36.88,15.75 36.85,15.72 36.83,15.72 36.83,15.24 23.81,2.22 15.56,2.22 15.24,2.54 15.24,8.89 17.14,10.79 22.1,10.79 22.76,11.46 22.76,23.98 19.3,27.43 IC2.16
  Bottom 0.203: v37.08,29.87 38.81,29.87 39.22,30.28 IC11.11
RIN
  Bottom 0.203: C13.1 54.56,45.31 53.44,45.31 R12.1 52.93,45.31 52.93,44.3 C9.1 52.43,43.38 52.02,42.98 46.63,42.98 45.31,44.3 IC1.23
ROUT  (via drill 0.25)
  Top 0.203: v78.08,43 78.23,42.86 78.23,18.14 80.56,15.8 J1.8
  Bottom 0.203: 76.2,43.18 C28.2 77.9,43.18 v78.08,43
SA8  (via drill 0.25)
  Top 0.203: v39.73,41.25 38.71,40.23 v38.71,29.26
  Bottom 0.203: v39.73,41.25 40.74,42.27 IC10.27 | v38.71,29.26 39.22,29.26 IC11.12
SA9  (via drill 0.25)
  Top 0.203: v40.23,43.18 41.05,42.37 v41.05,31.5
  Bottom 0.203: v40.23,43.18 40.34,43.18 40.74,43.59 IC10.26 | v41.05,31.5 41.55,30.99 41.55,28.14 41.15,28.14 IC11.13
SA10  (via drill 0.25)
  Top 0.203: v38.3,44.91 38.3,29.67 38.1,29.46 38.1,28.04 v38.71,27.43
  Bottom 0.203: v38.3,44.91 40.74,47.35 IC10.23 | v38.71,27.43 39.22,26.92 IC11.14
SA11  (via drill 0.25)
  Top 0.203: v39.62,43.69 39.62,42.16 40.54,41.25 40.54,33.02 v40.44,32.92
  Bottom 0.203: v39.62,43.69 40.74,44.81 IC10.25 | v40.44,32.92 41.96,31.39 41.96,25.6 41.15,25.6 IC11.15
SA12  (via drill 0.25)
  Top 0.203: v35.26,28.35 v35.26,39.32
  Bottom 0.203: v35.26,39.32 30.79,39.32 30.38,39.73 IC10.4 | v35.26,28.35 39.22,24.38 IC11.16
SA13  (via drill 0.25)
  Top 0.203: v37.69,24.59 v37.69,39.32
  Bottom 0.203: v37.69,39.32 39.01,39.32 40.74,41.05 IC10.28 | v37.69,24.59 39.22,23.06 IC11.17
SA14  (via drill 0.25)
  Top 0.203: v35.87,35.56 36.27,35.15 v36.27,24.79
  Bottom 0.203: v35.87,35.56 33.33,35.56 30.38,38.51 IC10.3 | v36.27,24.79 39.22,21.84 IC11.18
SA15  (via drill 0.25)
  Top 0.203: v39.32,35.76 39.32,21.44 v38.81,20.93
  Bottom 0.203: v39.32,35.76 40.74,37.19 IC10.31 | v38.81,20.93 39.22,20.52 IC11.19
SCIN
  Bottom 0.203: C6.1 56.69,54.15 56.69,53.14 R9.2 57.2,52.22 59.13,52.22 IC9.6
SCOUT  (via drill 0.25)
  Top 0.203: v54.56,51.21 52.63,49.28 52.63,26.11 45.01,18.49 IC1.8
  Bottom 0.203: v54.56,51.21 54.56,52.22 R9.1
SYNCIN
  Bottom 0.203: R11.2 56.69,59.23 56.69,57.61 C8.1 57.2,57.2 59.13,57.2 IC9.10
VCC  (via drill 0.3, 0.6)
  Top 0.61: JP1.13 2.23,48.97 1.22,49.99 1.22,64.01 2.03,64.82 10.29,64.82 10.32,64.79 10.32,64.15 13.01,61.47 C7.1 | 42.88,35.46 43.48,36.07 43.48,50.49 44.3,51.31 IC1.27 | 42.88,35.46 v41.96,34.54 41.86,34.34 41.86,19.2 v41.76,19.1 | v51.82,39.73 49.1,42.44 v49.1,47.32 | 42.88,35.46 v42.47,35.87 | IC1.4 53.95,10.77 v53.98,10.79
  Bottom 0.61: 40.95,10.57 40.95,9.35 R10.1 | 40.95,10.57 44.09,10.57 IC1.4 | 40.13,15.34 40.13,10.77 40.74,10.77 40.95,10.57 | 40.13,15.34 40.13,16.66 C29.2 39.62,17.58 39.62,18.8 IC11.20 41.15,19.1 v41.76,19.1 | IC2.20 18.49,38.61 18.49,39.93 C5.2 18.9,40.95 19,41.05 22.25,41.05 22.76,41.55 23.37,41.55 23.98,40.95 23.98,16.66 24.79,16.66 IC1.58 25.7,15.85 26.11,15.85 26.82,15.14 | 26.82,15.14 27.23,14.73 C4.1 | 40.13,15.34 27.03,15.34 26.82,15.14 | 12.9,60.55 12.9,58.52 R16.1 | 12.9,60.55 C7.1 13.92,61.16 15.14,62.38 46.23,62.38 49.17,59.44 49.37,59.44 | C19.1 8.94,60.76 12.7,60.76 12.9,60.55 | v41.96,34.54 41.35,34.54 C27.2 | v51.82,39.73 51.31,39.73 51.21,39.62 FB1.1 | 46.23,50.19 45.11,51.31 IC1.27 | 46.23,50.19 v49.1,47.32 | 49.37,59.44 51.21,59.44 51.51,59.13 51.51,54.46 50.49,54.46 46.23,50.19 | v42.47,35.87 41.96,35.87 41.86,35.97 IC10.32 | 49.37,59.44 49.37,59.37 49.11,59.11 R17.1 | v53.98,10.79 R15.2
VCC/2  (via drill 0.6)
  Top 0.203: v80.64,10.79 83.82,13.97 83.82,15.88 83.78,15.83 J1.5
  Bottom 0.203: R15.1 v80.64,10.79
VD0
  Bottom 0.203: IC10.13 29.26,51.21 26.11,48.06 26.11,46.94 25.4,46.94 IC1.41
VD1
  Bottom 0.203: IC10.14 30.38,52.43 30.79,52.02 30.79,48.26 28.85,48.26 25.6,45.01 IC1.42
VD2  (via drill 0.25)
  Top 0.203: v26.11,50.6 26.11,44.09 25.4,43.38 IC1.43
  Bottom 0.203: v26.11,50.6 29.26,53.75 IC10.15
VD3
  Bottom 0.203: IC10.17 41.86,54.97 42.27,54.56 42.27,48.26 40.44,48.26 34.34,42.16 34.34,40.64 25.6,40.64 IC1.44
VD4  (via drill 0.25)
  Top 0.203: v32.21,45.21 28.85,41.86 v28.85,38.1
  Bottom 0.203: v32.21,45.21 40.74,53.75 IC10.18 | v28.85,38.1 27.94,39.01 25.7,39.01 IC1.45
VD5  (via drill 0.25)
  Top 0.203: v32.92,45.11 29.46,41.66 29.46,36.17 v28.85,35.56
  Bottom 0.203: v32.92,45.11 38.81,51 39.32,51 40.74,52.43 IC10.19 | v28.85,35.56 27.23,37.19 25.7,37.19 IC1.46
VD6  (via drill 0.25)
  Top 0.203: v33.02,44.4 30.28,41.66 v30.28,35.26
  Bottom 0.203: v33.02,44.4 39.22,50.6 40.13,50.6 40.74,51.21 IC10.20 | v30.28,35.26 29.77,34.75 26.42,34.75 25.7,35.46 IC1.47
VD7  (via drill 0.25)
  Top 0.203: v36.68,35.56 v36.68,46.84
  Bottom 0.203: v36.68,46.84 40.03,50.19 40.74,50.19 IC10.21 | v36.68,35.56 35.26,34.14 25.7,34.14 IC1.48
YOUT
  Bottom 0.203: C25.2 77.11,59.03 80.06,59.03 J2.6

### Text on the board
tPlace: S-VIDEO | COMPOSITE | XRGB | V9958 VIDEO V1.0 | 2022 pugbutt.com